# Altium project power_board.PrjPcb (part 1 of 6)
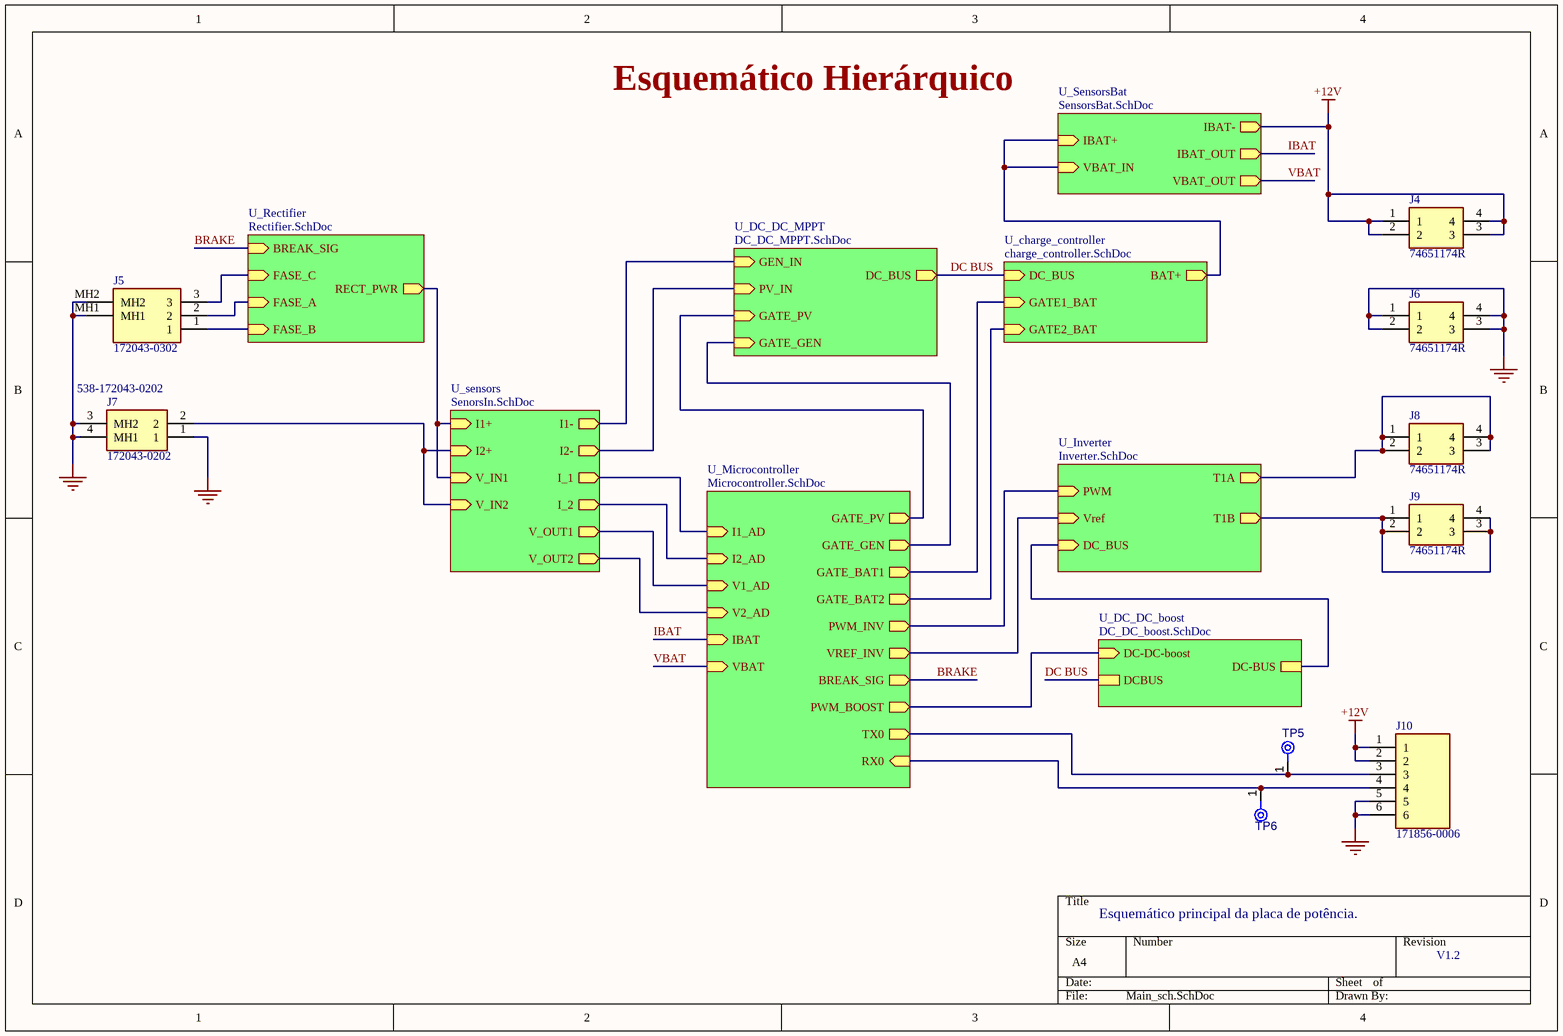
[diagram p0: Main_sch.SchDoc]
CAGE_CODE: ?????; CONTRACT_NUMBER: <CONTRACT NO>; DOC_NO_ASSY_DWG: <ASSY DWG NO>; DOC_NO_BOM: <BOM DOC NO>; DOC_NO_FAB_DWG: <FAB DWG NO>; DOC_NO_SCH_DWG: <SCH DWG NO>; PCB_2_DEC_TOL: +/-.01; PCB_3_DEC_TOL: +/-.010; PCB_ANG_TOL: +/-1/2; PCB_ASSEMBLY_NO: <PCB ASSY NO>; PCB_CHECKER: - -----; PCB_CHECKER_APP_DATE: --/--/----; PCB_DESIGNER: - -----; PCB_DESIGNER_APP_DATE: --/--/----; PCB_DWG_NO: <PCB DWG NO>; PCB_ENGINEER: - -----; PCB_ENGINEER_APP_DATE: --/--/----; PCB_PART_NUMBER: <PCB PN>; PCB_REV: A; SCH_REV: A
9 sheets, 193 parts. Net scope: hierarchical (ports join the sheet entries above them; power ports are global).
Board file: power_board.PcbDoc
Sheets:
  Main_sch.SchDoc
    U_Rectifier = Rectifier.SchDoc
    U_DC_DC_MPPT = DC_DC_MPPT.SchDoc
    U_sensors = SenorsIn.SchDoc
    U_Microcontroller = Microcontroller.SchDoc
    U_Inverter = Inverter.SchDoc
    U_SensorsBat = SensorsBat.SchDoc
    U_charge_controller = charge_controller.SchDoc
    U_DC_DC_boost = DC_DC_boost.SchDoc

## Sheet Main_sch.SchDoc
size A4; SheetNumber: 1; SheetTotal: 9

### Parts
J4  74651174R  [74651174R]
J5  172043-0302  [1720430302]
J6  74651174R  [74651174R]
J7  172043-0202  Supplier Part Number 1: 538-172043-0202  [1720430202]
J8  74651174R  [74651174R]
J9  74651174R  [74651174R]
J10  171856-0006  [HDRV6W99P0X254_1X6_1509X635X1100P]
TP5  TPAD6R  [TP06R]  (value not drawn)  (no BOM)
TP6  TPAD6R  [TP06R]  (value not drawn)  (no BOM)

### Sub-sheets
U_charge_controller = charge_controller.SchDoc: GATE1_BAT (in), GATE2_BAT (in), DC_BUS (in), BAT+ (out)
U_DC_DC_boost = DC_DC_boost.SchDoc: DC-DC-boost (in), DCBUS, DC-BUS
U_DC_DC_MPPT = DC_DC_MPPT.SchDoc: GATE_PV (in), PV_IN (in), GEN_IN (in), GATE_GEN (in), DC_BUS (out)
U_Inverter = Inverter.SchDoc: PWM (in), Vref (in), T1A (out), T1B (out), DC_BUS (in)
U_Microcontroller = Microcontroller.SchDoc: TX0 (out), RX0 (in), I1_AD (in), I2_AD (in), V1_AD (in), V2_AD (in), GATE_PV (out), GATE_GEN (out), IBAT (in), VBAT (in), GATE_BAT1 (out), GATE_BAT2 (out), BREAK_SIG (out), PWM_INV (out), VREF_INV (out), PWM_BOOST (out)
U_Rectifier = Rectifier.SchDoc: BREAK_SIG (in), FASE_C (in), FASE_A (in), FASE_B (in), RECT_PWR (out)
U_sensors = SenorsIn.SchDoc: I_2 (out), I_1 (out), V_IN1 (in), V_IN2 (in), V_OUT2 (out), V_OUT1 (out), I1- (out), I2- (out), I2+ (in), I1+ (in)
U_SensorsBat = SensorsBat.SchDoc: IBAT+ (in), IBAT- (out), IBAT_OUT (out), VBAT_IN (in), VBAT_OUT (out)

### Nets
+12V: J4.1 J4.2 J4.3 J4.4 J10.1 J10.2 ; sheet U_SensorsBat/IBAT-
GND: J5.MH1 J5.MH2 J6.1 J6.2 J6.3 J6.4 J7.1 J7.3(MH2) J7.4(MH1) J10.5 J10.6
BRAKE: sheet U_Rectifier/BREAK_SIG, sheet U_Microcontroller/BREAK_SIG
DC BUS: sheet U_DC_DC_MPPT/DC_BUS, sheet U_charge_controller/DC_BUS, sheet U_DC_DC_boost/DCBUS
DCBUS: sheet U_Inverter/DC_BUS, sheet U_DC_DC_boost/DC-BUS
IBAT: sheet U_Microcontroller/IBAT, sheet U_SensorsBat/IBAT_OUT
VBAT: sheet U_Microcontroller/VBAT, sheet U_SensorsBat/VBAT_OUT
NetC5_1: sheet U_DC_DC_MPPT/PV_IN, sheet U_sensors/I2-
NetC15_1: sheet U_Rectifier/RECT_PWR, sheet U_sensors/V_IN1, sheet U_sensors/I1+
NetC28_1: J8.1 J8.2 J8.3 J8.4 ; sheet U_Inverter/T1A
NetC28_2: J9.1 J9.2 J9.3 J9.4 ; sheet U_Inverter/T1B
NetD7_2: J5.2 ; sheet U_Rectifier/FASE_A
NetD9_2: J5.1 ; sheet U_Rectifier/FASE_B
NetD11_2: J5.3 ; sheet U_Rectifier/FASE_C
NetFL1_1: sheet U_DC_DC_MPPT/GEN_IN, sheet U_sensors/I1-
NetIC1_1: sheet U_DC_DC_MPPT/GATE_PV, sheet U_Microcontroller/GATE_PV
NetIC2_1: sheet U_DC_DC_MPPT/GATE_GEN, sheet U_Microcontroller/GATE_GEN
NetIC3_1: sheet U_Microcontroller/GATE_BAT1, sheet U_charge_controller/GATE1_BAT
NetIC4_1: sheet U_Microcontroller/GATE_BAT2, sheet U_charge_controller/GATE2_BAT
NetIC7_1: sheet U_Microcontroller/PWM_BOOST, sheet U_DC_DC_boost/DC-DC-boost
NetJ7_2: J7.2 ; sheet U_sensors/V_IN2, sheet U_sensors/I2+
NetJ10_3: J10.3 TP5.1(TP) ; sheet U_Microcontroller/TX0
NetJ10_4: J10.4 TP6.1(TP) ; sheet U_Microcontroller/RX0
NetL2_2: sheet U_SensorsBat/IBAT+, sheet U_SensorsBat/VBAT_IN, sheet U_charge_controller/BAT+
NetR5_2: sheet U_sensors/I_1, sheet U_Microcontroller/I1_AD
NetR11_2: sheet U_sensors/I_2, sheet U_Microcontroller/I2_AD
NetR32_1: sheet U_Microcontroller/PWM_INV, sheet U_Inverter/PWM
NetTP1_1: sheet U_sensors/V_OUT1, sheet U_Microcontroller/V1_AD
NetTP2_1: sheet U_sensors/V_OUT2, sheet U_Microcontroller/V2_AD
NetU7_9: sheet U_Microcontroller/VREF_INV, sheet U_Inverter/Vref

### Notes on the sheet
- Esquemático Hierárquico
- Esquemático principal da placa de potência.
- V1.2

### Library data of the parts
J4 J6 J8 J9 = 74651174R: SHANK, THR; Manufacturer_Name: Wurth Elektronik; Manufacturer: Wurth Electronics; Current Rating: 50A; Datasheet Link: https://componentsearchengine.com/Datasheets/1/74651174R.pdf; Height: 11mm; Manufacturer_Part_Number: 74651174R; Mouser Part Number: 710-74651174R; Mouser Price/Stock: https://www.mouser.co.uk/ProductDetail/Wurth-Elektronik/74651174R?qs=lBTPRtX1sU9uJ5vjuYZPZA%3D%3D; Supplier 1: Mouser; Supplier Part Number 1: 710-74651174R; Manufacturer Part Number: 74651174R; RoHS: Yes; Category: Terminals; Stock 1: 997; Pricing 1: 1=3.26000, 10=3.02000, 50=2.71000, 100=2.45000, 1000=2.06000, 10000=2.06000 (USD); Mount: Through Hole; Number of Pins: 4; Contact Plating: Tin; Contact Material: Brass; Termination: Solder; RoHS Compliant: Yes; ComponentLink1URL: http://katalog.we-online.de/em/datasheet/74651174R.pdf?src-supplier=Digi-Key; ComponentLink1Description: http://katalog.we-online.de/em/datasheet/74651174R.pdf?src-supplier=Digi-Key; ComponentLink2URL: https://katalog.we-online.de/em/datasheet/74651174R.pdf?src-supplier=Digi-Key; ComponentLink2Description: https://katalog.we-online.de/em/datasheet/74651174R.pdf?src-supplier=Digi-Key
J5 = 172043-0302: Conn Power HDR 3 POS 7.49mm Solder RA Thru-Hole 3 Terminal 1 Port Super Sabre™ Frame; Manufacturer_Name: Molex; Number of Positions: 3; Voltage Rating: 600V; Current Rating: 30A; Pitch: 0.295inch; Glow Wire Compliant: Compliant; Datasheet Link: https://www.molex.com/pdm_docs/sd/1720430401_sd.pdf; Height: 11.53mm; Manufacturer_Part_Number: 172043-0302; ComponentLink1URL: http://www.molex.com/pdm_docs/sd/1720430202_sd.pdf?src-supplier=Avnet; ComponentLink1Description: http://www.molex.com/pdm_docs/sd/1720430202_sd.pdf?src-supplier=Avnet; ComponentLink2URL: http://www.molex.com/pdm_docs/sd/1720430302_sd.pdf?src-supplier=Digi-Key; ComponentLink2Description: http://www.molex.com/pdm_docs/sd/1720430302_sd.pdf?src-supplier=Digi-Key; ComponentLink3URL: https://www.molex.com/pdm_docs/sd/1720430302_sd.pdf?src-supplier=Digi-Key; ComponentLink3Description: https://www.molex.com/pdm_docs/sd/1720430302_sd.pdf?src-supplier=Digi-Key; ComponentLink4URL: https://www.mouser.com/ds/2/276/1720430202_PCB_HEADERS-704499.pdf?src-supplier=Mouser; ComponentLink4Description: https://www.mouser.com/ds/2/276/1720430202_PCB_HEADERS-704499.pdf?src-supplier=Mouser; ComponentLink5URL: http://www.literature.molex.com/SQLImages/kelmscott/Molex/PDF_Images/987650-1349.PDF?src-supplier=Digi-Key; ComponentLink5Description: http://www.literature.molex.com/SQLImages/kelmscott/Molex/PDF_Images/987650-1349.PDF?src-supplier=Digi-Key; ComponentLink6URL: http://www.molex.com/pdm_docs/sd/1720430202_sd.pdf?src-supplier=Digi-Key; ComponentLink6Description: http://www.molex.com/pdm_docs/sd/1720430202_sd.pdf?src-supplier=Digi-Key; Supplier 1: Mouser; Supplier Part Number 1: 538-172043-0302; Manufacturer: Molex; Manufacturer Part Number: 1720430302; RoHS: Yes; Category: Headers and Wire Housings; Stock 1: 770; Pricing 1: 1=4.13000, 10=3.64000, 50=3.64000, 100=2.90000, 1000=2.39000, 10000=2.23000 (USD); Mount: Through Hole; Number of Pins: 3; Color: Black; Contact Material: Copper; Contact Plating: Silver; Insulation Material: Polymer; Min Operating Temperature: -40°C; Max Operating Temperature: 125°C; Packaging: Tray; Number of Rows: 1; Termination: Solder; Fastening Type: Ramp; Orientation: Right Angle; Number of Circuits: 3; Halogen Free: Low Halogen; RoHS Compliant: Yes
J7 = 172043-0202: CONN HDR 2POS 7.50MM R/A SLDR; Manufacturer_Name: Molex; Number of Positions: 2; Voltage Rating: 600V; Current Rating: 30A; Pitch: 0.295inch; Datasheet Link: https://www.molex.com/pdm_docs/sd/1720430202_sd.pdf; Height: 11.68mm; Manufacturer_Part_Number: 172043-0202; Mouser Part Number: 538-172043-0202; Mouser Price/Stock: https://www.mouser.co.uk/ProductDetail/Molex/172043-0202?qs=AUG1J5sL7zJwcA2Oseq0RA%3D%3D; Supplier 1: Mouser; Manufacturer: Molex; Manufacturer Part Number: 1720430202; RoHS: Yes; Category: Cables and Wire; Stock 1: 939; Pricing 1: 1=2.21000, 10=1.89000, 50=1.89000, 100=1.56000, 1000=1.22000, 10000=1.08000 (USD); Mount: Through Hole; Number of Pins: 2; Color: Black; Contact Material: Copper; Contact Plating: Silver; Insulation Material: Polymer; Min Operating Temperature: -40°C; Max Operating Temperature: 125°C; Packaging: Tray; Number of Rows: 1; Termination: Solder; Fastening Type: Ramp; Orientation: Right Angle; Number of Circuits: 2; RoHS Compliant: Yes; ComponentLink1URL: https://www.mouser.com/ds/2/276/1720430202_PCB_HEADERS-704499.pdf?src-supplier=Mouser; ComponentLink1Description: https://www.mouser.com/ds/2/276/1720430202_PCB_HEADERS-704499.pdf?src-supplier=Mouser; ComponentLink2URL: http://www.molex.com/pdm_docs/sd/1720430202_sd.pdf?src-supplier=Avnet; ComponentLink2Description: http://www.molex.com/pdm_docs/sd/1720430202_sd.pdf?src-supplier=Avnet; ComponentLink3URL: http://www.literature.molex.com/SQLImages/kelmscott/Molex/PDF_Images/987650-1349.PDF?src-supplier=Digi-Key; ComponentLink3Description: http://www.literature.molex.com/SQLImages/kelmscott/Molex/PDF_Images/987650-1349.PDF?src-supplier=Digi-Key; ComponentLink4URL: http://www.molex.com/pdm_docs/sd/1720430202_sd.pdf?src-supplier=Digi-Key; ComponentLink4Description: http://www.molex.com/pdm_docs/sd/1720430202_sd.pdf?src-supplier=Digi-Key
J10 = 171856-0006: Conn Wire to Board HDR 6 POS 2.54mm Solder ST Thru-Hole KK® Bag; Manufacturer_Name: Molex; Current Rating: 4A; Voltage Rating: 250V; Number of Positions: 6; Gender: Male; Connector Type: Male Pin; Contact Post Length: 2.34mm; Glow Wire Compliant: Compliant; Datasheet Link: https://www.molex.com/pdm_docs/sd/1718560006_sd.pdf; Height: 11mm; Manufacturer_Part_Number: 171856-0006; Mouser Part Number: 538-171856-0006; Mouser Price/Stock: https://www.mouser.co.uk/ProductDetail/Molex/171856-0006?qs=s7UCm7gO1bZ%2FF4kPA9T7bA%3D%3D; Supplier 1: Mouser; Supplier Part Number 1: 538-171856-0006; Manufacturer: Molex; Manufacturer Part Number: 171856-0006; RoHS: Yes; Category: Headers and Wire Housings; Stock 1: 7773; Pricing 1: 1=0.52000, 10=0.44100, 50=0.44100, 100=0.34400, 1000=0.27000, 10000=0.22000 (USD); Mount: Through Hole; Contact Plating: Tin,Matte; Contact Material: Brass,Tin; Color: Black; Housing Color: Black; Housing Material: Nylon; Weight: 0.023916oz; Min Operating Temperature: -40°C; Max Operating Temperature: 105°C; Number of Rows: 1; Contact Gender: Male; Packaging: Bulk; Package Quantity: 2000; Fastening Type: Friction; Termination: Solder; Number of Contacts: 6; Orientation: Vertical; Number of Circuits: 6; Length: 15.09mm; Pitch: 2.54mm; Contact Mating Length: 0.293inch; Depth: 6.35mm; Radiation Hardening: No; REACH SVHC: Unknown; Halogen Free: Low Halogen; Flammability Rating: UL94 V-2; RoHS Compliant: Yes; ComponentLink1URL: https://datasheet.ciiva.com/24135/1718560006-pcb-headers-295618-24135976.pdf?src-supplier=Mouser; ComponentLink1Description: https://datasheet.ciiva.com/24135/1718560006-pcb-headers-295618-24135976.pdf?src-supplier=Mouser; ComponentLink2URL: https://datasheet.ciiva.com/30069/162461718560006-pcb-headers-30069863.pdf?src-supplier=Onlinecomponents.com; ComponentLink2Description: https://datasheet.ciiva.com/30069/162461718560006-pcb-headers-30069863.pdf?src-supplier=Onlinecomponents.com; ComponentLink3URL: https://datasheet.ciiva.com/28500/1769843-28500365.pdf?src-supplier=Element14; ComponentLink3Description: https://datasheet.ciiva.com/28500/1769843-28500365.pdf?src-supplier=Element14; ComponentLink4URL: https://datasheet.ciiva.com/30492/0900766b8129e59b-30492739.pdf?src-supplier=RSComponents; ComponentLink4Description: https://datasheet.ciiva.com/30492/0900766b8129e59b-30492739.pdf?src-supplier=RSComponents; ComponentLink5URL: https://datasheet.ciiva.com/29948/1718560002-sd-29948527.pdf?src-supplier=Avnet; ComponentLink5Description: https://datasheet.ciiva.com/29948/1718560002-sd-29948527.pdf?src-supplier=Avnet; ComponentLink6URL: https://datasheet.ciiva.com/30514/70314281-30514598.pdf?src-supplier=Allied+Electronics; ComponentLink6Description: https://datasheet.ciiva.com/30514/70314281-30514598.pdf?src-supplier=Allied+Electronics
TP5 TP6 = CMP-00028-00002-2: 0.6mm round; Pins: 1

## Sheet Rectifier.SchDoc
size A4; SheetNumber: 5; SheetTotal: 9
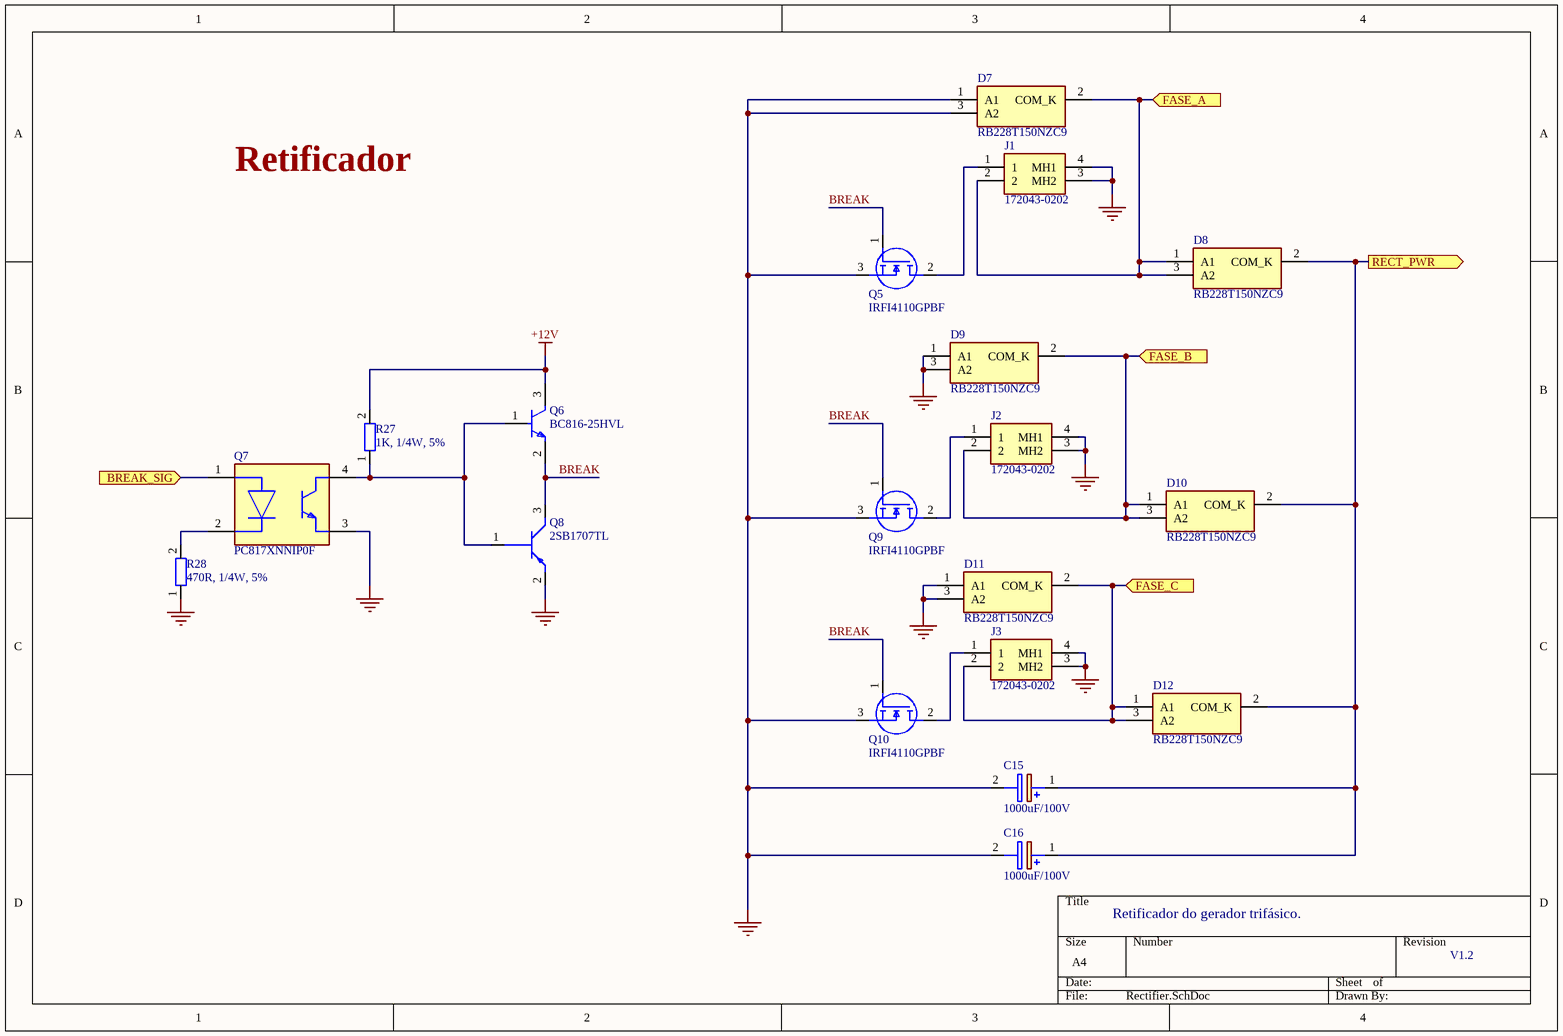
[diagram p1: Rectifier.SchDoc]

### Parts
C15  1000uF/100V  [CAPPRD750W85D1800H3750]
C16  1000uF/100V  [CAPPRD750W85D1800H3750]
D7  RB228T150NZC9  [TO254P480X1010X2100-3P]
D8  RB228T150NZC9  [TO254P480X1010X2100-3P]
D9  RB228T150NZC9  [TO254P480X1010X2100-3P]
D10  RB228T150NZC9  [TO254P480X1010X2100-3P]
D11  RB228T150NZC9  [TO254P480X1010X2100-3P]
D12  RB228T150NZC9  [TO254P480X1010X2100-3P]
J1  172043-0202  [1720430202]
J2  172043-0202  [1720430202]
J3  172043-0202  [1720430202]
Q5  IRFI4110GPBF  [TO254P483X1018X2095-3P]
Q6  BC816-25HVL  [FP-SOT23-IPC_C]
Q7  PC817XNNIP0F  [FP-PC817XNNIP0F-MFG]
Q8  2SB1707TL  [SOT95P280X100-3N]
Q9  IRFI4110GPBF  [TO254P483X1018X2095-3P]
Q10  IRFI4110GPBF  [TO254P483X1018X2095-3P]
R27  1K, 1/4W, 5%  [RES-0805]
R28  470R, 1/4W, 5%  [RES-0805]

### Ports
BREAK_SIG (in), FASE_A (in), FASE_B (in), FASE_C (in), RECT_PWR (out)

### Nets
+12V: Q6.3(C) R27.2
GND: C15.2(-) C16.2(-) D7.1(A1) D7.3(A2) D9.1(A1) D9.3(A2) D11.1(A1) D11.3(A2) J1.3(MH2) J1.4(MH1) J2.3(MH2) J2.4(MH1) J3.3(MH2) J3.4(MH1) Q5.3(S) Q7.3(E) Q8.2(E) Q9.3(S) Q10.3(S) R28.1
BRAKE: Q7.1(A) ; port BREAK_SIG
BREAK: Q5.1(G) Q6.2(E) Q8.3(C) Q9.1(G) Q10.1(G)
NetC15_1: C15.1(+) C16.1(+) D8.2(COM_K) D10.2(COM_K) D12.2(COM_K) ; port RECT_PWR
NetD7_2: D7.2(COM_K) D8.1(A1) D8.3(A2) J1.2 ; port FASE_A
NetD9_2: D9.2(COM_K) D10.1(A1) D10.3(A2) J2.2 ; port FASE_B
NetD11_2: D11.2(COM_K) D12.1(A1) D12.3(A2) J3.2 ; port FASE_C
NetJ1_1: J1.1 Q5.2(D)
NetJ2_1: J2.1 Q9.2(D)
NetJ3_1: J3.1 Q10.2(D)
NetQ6_1: Q6.1(B) Q7.4(C) Q8.1(B) R27.1
NetQ7_2: Q7.2(C) R28.2

### Notes on the sheet
- Retificador
- Retificador do gerador trifásico.
- V1.2

### Library data of the parts
C15 C16 = ECA-2AHG102: Aluminum Electrolytic Capacitors - Leaded 1000uF 100V; Manufacturer_Name: Panasonic; Capacitance: 1mF; Tolerance: 20%; Ripple Current: 985mA; Leakage Current: 3uA; Life (Hours): 2000Hour; Dissipation Factor: 0.08%; Lead/Base Style: Straight; Lead Diameter: 0.8mm; Datasheet Link: http://www.mouser.com/ds/2/315/ABA0000C1215-1109177.pdf; Height: 37.5mm; Manufacturer_Part_Number: ECA-2AHG102; Mouser Part Number: 667-ECA-2AHG102; Mouser Price/Stock: https://www.mouser.co.uk/ProductDetail/Panasonic/ECA-2AHG102/?qs=rrcJgg%2Fw9KxYcZZHtVYgiQ%3D%3D; Arrow Part Number: ECA-2AHG102; Arrow Price/Stock: https://www.arrow.com/en/products/eca-2ahg102/panasonic; Supplier 1: Mouser; Supplier Part Number 1: 667-ECA-2AHG102; Manufacturer: Panasonic; Manufacturer Part Number: ECA-2AHG102; RoHS: Yes; Category: Aluminum Electrolytic Capacitors; Stock 1: 994; Pricing 1: 1=2.62000, 10=1.75000, 50=1.75000, 100=1.60000, 1000=1.07000, 10000=1.07000 (USD); Mount: Through Hole,PCB; Case/Package: Radial; Number of Pins: 2; Contact Plating: Tin; Min Operating Temperature: -55°C; Max Operating Temperature: 105°C; Termination: Radial; Voltage Rating: 100V; Packaging: Bulk; Package Quantity: 50; Voltage Rating (DC): 100V; Voltage: 100V; Series: NHG; Construction: RADIAL; Diameter: 18mm; Length: 35.5mm; Width: 18mm; Lead Pitch: 7.5mm; Height - Seated (Max): 1.476inch; Radiation Hardening: No; REACH SVHC: No SVHC; Lead Free: Lead Free; RoHS Compliant: Yes; ComponentLink1URL: https://datasheet.ciiva.com/2984/aba0000ce26-2984390.pdf?src-supplier=Avnet; ComponentLink1Description: https://datasheet.ciiva.com/2984/aba0000ce26-2984390.pdf?src-supplier=Avnet; ComponentLink2URL: https://datasheet.ciiva.com/43459/1790596-43459676.pdf?src-supplier=Farnell; ComponentLink2Description: https://datasheet.ciiva.com/43459/1790596-43459676.pdf?src-supplier=Farnell; ComponentLink3URL: https://datasheet.ciiva.com/24027/aba0000ce26-372437-24027279.pdf?src-supplier=Mouser; ComponentLink3Description: https://datasheet.ciiva.com/24027/aba0000ce26-372437-24027279.pdf?src-supplier=Mouser; ComponentLink4URL: https://datasheet.ciiva.com/30158/8aba0000ce26-30158524.pdf?src-supplier=Onlinecomponents.com; ComponentLink4Description: https://datasheet.ciiva.com/30158/8aba0000ce26-30158524.pdf?src-supplier=Onlinecomponents.com; ComponentLink5URL: https://datasheet.ciiva.com/16387/aba0000ce26-16387053.pdf?src-supplier=Future+Electronics; ComponentLink5Description: https://datasheet.ciiva.com/16387/aba0000ce26-16387053.pdf?src-supplier=Future+Electronics; ComponentLink6URL: https://datasheet.ciiva.com/14594/70067776-14594090.pdf?src-supplier=Allied+Electronics; ComponentLink6Description: https://datasheet.ciiva.com/14594/70067776-14594090.pdf?src-supplier=Allied+Electronics; ComponentLink7URL: https://datasheet.ciiva.com/15198/getdatasheetpartid-470872-15198006.pdf?src-supplier=Verical; ComponentLink7Description: https://datasheet.ciiva.com/15198/getdatasheetpartid-470872-15198006.pdf?src-supplier=Verical; ComponentLink8URL: https://datasheet.ciiva.com/17533/aba0000ce26-17533421.pdf?src-supplier=Avnet+Europe; ComponentLink8Description: https://datasheet.ciiva.com/17533/aba0000ce26-17533421.pdf?src-supplier=Avnet+Europe; ComponentLink9URL: https://datasheet.ciiva.com/29248/792491-da-01-en-elko-nhg-r-1000uf-100v-105c-29248620.pdf?src-supplier=Conrad; ComponentLink9Description: https://datasheet.ciiva.com/29248/792491-da-01-en-elko-nhg-r-1000uf-100v-105c-29248620.pdf?src-supplier=Conrad
D7-D12 = RB228T150NZC9: Schottky Diode; Manufacturer_Name: ROHM Semiconductor; Manufacturer: Rohm; Datasheet Link: https://fscdn.rohm.com/en/products/databook/datasheet/discrete/diode/schottky_barrier/rb228t150nz-e.pdf; Height: 4.8mm; Manufacturer_Part_Number: RB228T150NZC9; Supplier 1: Mouser; Supplier Part Number 1: 755-RB228T150NZC9; Manufacturer Part Number: RB228T150NZC9; RoHS: Yes; Stock 1: 982; Pricing 1: 1=1.74000, 10=1.48000, 50=1.48000, 100=1.14000, 1000=0.82400, 10000=0.78200 (USD)
J1-J3 = 172043-0202: as J7 on sheet Main_sch; Datasheet Link: https://www.molex.com/pdm_docs/sd/1720430202_sd.pdf; Height: 11.68mm; Manufacturer_Part_Number: 172043-0202; Mouser Part Number: 538-172043-0202; Mouser Price/Stock: https://www.mouser.co.uk/ProductDetail/Molex/172043-0202?qs=AUG1J5sL7zJwcA2Oseq0RA%3D%3D; Supplier 1: Mouser; Supplier Part Number 1: 538-172043-0202; Manufacturer: Molex; Manufacturer Part Number: 1720430202; RoHS: Yes; Category: Cables and Wire; Stock 1: 939; Pricing 1: 1=2.21000, 10=1.89000, 50=1.89000, 100=1.56000, 1000=1.22000, 10000=1.08000 (USD); Mount: Through Hole; Number of Pins: 2; Color: Black; Contact Material: Copper; Contact Plating: Silver; Insulation Material: Polymer; Min Operating Temperature: -40°C; Max Operating Temperature: 125°C; Packaging: Tray; Number of Rows: 1; Termination: Solder; Fastening Type: Ramp; Orientation: Right Angle; Number of Circuits: 2; RoHS Compliant: Yes; ComponentLink1URL: https://www.mouser.com/ds/2/276/1720430202_PCB_HEADERS-704499.pdf?src-supplier=Mouser; ComponentLink1Description: https://www.mouser.com/ds/2/276/1720430202_PCB_HEADERS-704499.pdf?src-supplier=Mouser; ComponentLink2URL: http://www.molex.com/pdm_docs/sd/1720430202_sd.pdf?src-supplier=Avnet; ComponentLink2Description: http://www.molex.com/pdm_docs/sd/1720430202_sd.pdf?src-supplier=Avnet; ComponentLink3URL: http://www.literature.molex.com/SQLImages/kelmscott/Molex/PDF_Images/987650-1349.PDF?src-supplier=Digi-Key; ComponentLink3Description: http://www.literature.molex.com/SQLImages/kelmscott/Molex/PDF_Images/987650-1349.PDF?src-supplier=Digi-Key; ComponentLink4URL: http://www.molex.com/pdm_docs/sd/1720430202_sd.pdf?src-supplier=Digi-Key; ComponentLink4Description: http://www.molex.com/pdm_docs/sd/1720430202_sd.pdf?src-supplier=Digi-Key
Q5 Q9 Q10 = IRFI4110GPBF: MOSFET N-CH 100V 72A TO220AB; Manufacturer_Name: Infineon; Rds On Max: 4.5mR; Input Capacitance: 9.54nF; Max Power Dissipation: 61W; Threshold Voltage: 4V; Datasheet Link: https://www.mouser.co.uk/datasheet/2/196/Infineon-IRFI4110G-DS-v01_02-EN-1227339.pdf; Height: 4.83mm; Manufacturer_Part_Number: IRFI4110GPBF; Mouser Part Number: 942-IRFI4110GPBF; Mouser Price/Stock: https://www.mouser.com/Search/Refine.aspx?Keyword=942-IRFI4110GPBF; Arrow Part Number: IRFI4110GPBF; Arrow Price/Stock: https://www.arrow.com/en/products/irfi4110gpbf/infineon-technologies-ag; Supplier 1: Mouser; Supplier Part Number 1: 942-IRFI4110GPBF; Manufacturer: Infineon; Manufacturer Part Number: IRFI4110GPBF; RoHS: Yes; Category: MOSFETs; Stock 1: 1795; Pricing 1: 1=3.31000, 10=2.79000, 50=2.63000, 100=2.25000, 1000=1.72000, 10000=1.59000 (USD); Mount: Through Hole; Case/Package: TO-220-3; Number of Pins: 3; Min Operating Temperature: -55°C; Max Operating Temperature: 175°C; Continuous Drain Current (ID): 72A; Packaging: Rail/Tube; Drain to Source Voltage (Vdss): 100V; Max Dual Supply Voltage: 100V; REACH SVHC: No SVHC; Lead Free: Lead Free; RoHS Compliant: Yes; Halogen Free: Halogen Free; ComponentLink1URL: http://www.infineon.com/dgdl/irfi4110gpbf.pdf?fileId=5546d462533600a401535623f28d1f78&src-supplier=Digi-Key; ComponentLink1Description: http://www.infineon.com/dgdl/irfi4110gpbf.pdf?fileId=5546d462533600a401535623f28d1f78&src-supplier=Digi-Key; ComponentLink2URL: http://www.farnell.com/datasheets/1302157.pdf?src-supplier=Element14; ComponentLink2Description: http://www.farnell.com/datasheets/1302157.pdf?src-supplier=Element14
Q6 = CMP-14406-000028-1: BC816-25H/SOT23/TO-236AB; Manufacturer: Nexperia; Supplier 1: Mouser; Supplier Part Number 1: 771-BC816-25HVL; Manufacturer Part Number: BC816-25HVL; RoHS: No; Stock 1: 11733; Pricing 1: 1=0.25000, 10=0.17100, 50=0.17100, 100=0.08300, 1000=0.04800, 10000=0.03200 (USD)
Q7 = CMP-65434-000005-1: OPTOISOLATOR 5KV TRANS 4SMD; Manufacturer: Sharp; Reverse Breakdown Voltage: 6V; Output Current per Channel: 30mA; Power Dissipation: 200mW; Collector-emitter Voltage-Max: 200mV; Max Output Voltage: 80V; Input Current: 50mA; Forward Voltage: 1.4V; Fall Time: 18000ns; Number of Elements: 1; Input Type: DC; Packaging: Tape and Reel; RoHS Compliant: Yes; Contact Plating: Copper; Min Operating Temperature: -30°C; Collector Emitter Saturation Voltage: 200mV; Max Input Current: 50mA; Radiation Hardening: No; Max Collector Current: 50mA; Case/Package: SMD/SMT; Mount: Surface Mount; Output Voltage: 80V; Forward Current: 50mA; Max Power Dissipation: 200mW; Collector Emitter Voltage (VCEO): 80V; Number of Channels: 1; Rise Time: 18000ns; Isolation Voltage: 5kV; Number of Pins: 4; Lead Free: Lead Free; Package Quantity: 2000; Isolation Voltage-Max: 5kV; Max Operating Temperature: 100°C; Supplier 1: Digi-Key; Supplier Part Number 1: 425-2774-1-ND; Manufacturer Part Number: PC817XNNIP0F; RoHS: Yes; Category: Optocouplers; REACH SVHC: Unknown; ComponentLink1URL: https://datasheet.ciiva.com/15119/getdatasheetpartid-299374-15119023.pdf?src-supplier=Verical; ComponentLink1Description: https://datasheet.ciiva.com/15119/getdatasheetpartid-299374-15119023.pdf?src-supplier=Verical; ComponentLink2URL: https://datasheet.ciiva.com/2086/pc817xxnip0f-series-2086507.pdf?src-supplier=Digi-Key; ComponentLink2Description: https://datasheet.ciiva.com/2086/pc817xxnip0f-series-2086507.pdf?src-supplier=Digi-Key; ComponentLink3URL: https://datasheet.ciiva.com/2086/pc817xxnip0f-series-2086508.pdf?src-supplier=Digi-Key; ComponentLink3Description: https://datasheet.ciiva.com/2086/pc817xxnip0f-series-2086508.pdf?src-supplier=Digi-Key; ComponentLink4URL: https://datasheet.ciiva.com/2086/pc817xxnip0f-series-2086509.pdf?src-supplier=Digi-Key; ComponentLink4Description: https://datasheet.ciiva.com/2086/pc817xxnip0f-series-2086509.pdf?src-supplier=Digi-Key; ComponentLink5URL: https://datasheet.ciiva.com/16475/pc817xnnip0f-16475911.pdf?src-supplier=Future+Electronics; ComponentLink5Description: https://datasheet.ciiva.com/16475/pc817xnnip0f-16475911.pdf?src-supplier=Future+Electronics; ComponentLink6URL: https://datasheet.ciiva.com/25900/pc817xxnip0f-series-25900837.pdf?src-supplier=Avnet+Europe; ComponentLink6Description: https://datasheet.ciiva.com/25900/pc817xxnip0f-series-25900837.pdf?src-supplier=Avnet+Europe; ComponentLink7URL: https://datasheet.ciiva.com/46396/1812378-46396954.pdf?src-supplier=Element14; ComponentLink7Description: https://datasheet.ciiva.com/46396/1812378-46396954.pdf?src-supplier=Element14; ComponentLink8URL: https://datasheet.ciiva.com/46435/1812378-46435723.pdf?src-supplier=Element14; ComponentLink8Description: https://datasheet.ciiva.com/46435/1812378-46435723.pdf?src-supplier=Element14
Q8 = 2SB1707TL: TRANS PNP 12V 4A TSMT3; Manufacturer_Name: ROHM Semiconductor; Manufacturer: Rohm; Max Power Dissipation: 500mW; Collector Base Voltage (VCBO): -15V; hFE Min: 270; Transition Frequency: 250MHz; Emitter Base Voltage (VEBO): -6V; Collector Emitter Saturation Voltage: -150mV; Element Configuration: Single; Continuous Collector Current: -4A; Max Frequency: 100MHz; Voltage Rating (DC): -12V; Collector-emitter Voltage-Max: 250mV; Datasheet Link: https://fscdn.rohm.com/en/products/databook/datasheet/discrete/transistor/bipolar/2sb1707tl-e.pdf; Height: 1mm; Manufacturer_Part_Number: 2SB1707TL; Mouser Part Number: 755-2SB1707TL; Mouser Price/Stock: https://www.mouser.com/Search/Refine.aspx?Keyword=755-2SB1707TL; Supplier 1: Mouser; Supplier Part Number 1: 755-2SB1707TL; Manufacturer Part Number: 2SB1707TL; RoHS: Yes; Category: BJTs; Stock 1: 2939; Pricing 1: 1=0.69000, 10=0.57100, 50=0.57100, 100=0.34600, 1000=0.29500, 10000=0.25200 (USD); Mount: Surface Mount; Case/Package: TO-236-3; Number of Pins: 3; Contact Plating: Copper,Tin,Silver; Min Operating Temperature: -55°C; Max Operating Temperature: 150°C; Collector Emitter Voltage (VCEO): 12V; Max Collector Current: 4A; Packaging: Tape and Reel; Package Quantity: 3000; Polarity: PNP; Collector Emitter Breakdown Voltage: 12V; Max Breakdown Voltage: 12V; Gain Bandwidth Product: 250MHz; Current Rating: -4A; Series: -; Length: 2.9mm; Width: 1.6mm; Radiation Hardening: No; Lead Free: Lead Free; RoHS Compliant: Yes; ComponentLink1URL: https://datasheet.ciiva.com/978/2sb1707-978075.pdf?src-supplier=Digi-Key; ComponentLink1Description: https://datasheet.ciiva.com/978/2sb1707-978075.pdf?src-supplier=Digi-Key; ComponentLink2URL: https://datasheet.ciiva.com/11203/2sb1707-11203670.pdf?src-supplier=Avnet; ComponentLink2Description: https://datasheet.ciiva.com/11203/2sb1707-11203670.pdf?src-supplier=Avnet; ComponentLink3URL: https://datasheet.ciiva.com/16289/2sb1707-210615-16289360.pdf?src-supplier=Mouser; ComponentLink3Description: https://datasheet.ciiva.com/16289/2sb1707-210615-16289360.pdf?src-supplier=Mouser; ComponentLink4URL: https://datasheet.ciiva.com/978/2sb1707-978076.pdf?src-supplier=Digi-Key; ComponentLink4Description: https://datasheet.ciiva.com/978/2sb1707-978076.pdf?src-supplier=Digi-Key; ComponentLink5URL: https://datasheet.ciiva.com/978/2sb1707-978077.pdf?src-supplier=Digi-Key; ComponentLink5Description: https://datasheet.ciiva.com/978/2sb1707-978077.pdf?src-supplier=Digi-Key
R27 = Res-0805: Res General Purpose Thick Film 0805 1k Ohm 5% 1/4W ±200ppm/°C Molded Paper T/R; Manufacturer_Name: YAGEO (PHYCOMP); Manufacturer_Part_Number: RC0805JR-131KL; Manufacturer: Yageo; Manufacturer Part Number: RC0805JR-7W1KL; Resistance: 1kR; Datasheet Link: http://www.yageo.com/documents/recent/PYu-RC_Group_51_RoHS_L_10.pdf; Height: 0.6mm; Mouser Part Number: 603-RC0805JR-131KL; Mouser Price/Stock: https://www.mouser.com/Search/Refine.aspx?Keyword=603-RC0805JR-131KL; Supplier 1: Mouser; Supplier Part Number 1: 603-RC0805JR-7W1KL; RoHS: Yes; Category: Resistors; Stock 1: 3681; Pricing 1: 1=0.17000, 10=0.10800, 50=0.10800, 100=0.03500, 1000=0.02500, 10000=0.01800 (USD); Case/Package: 0805; Tolerance: 5%; RoHS Compliant: Yes
R28 = Res-0805: Thick Film Resistors - SMD 470 OHM 5%; Manufacturer_Name: YAGEO (PHYCOMP); Manufacturer_Part_Number: RC0805JR-131KL; Manufacturer: Yageo; Manufacturer Part Number: RC0805JR-13470RL; Temperature Coefficient: 100ppm/°C; Power Rating: 125mW; Voltage Rating: 150V; Datasheet Link: http://www.yageo.com/documents/recent/PYu-RC_Group_51_RoHS_L_10.pdf; Height: 0.6mm; Mouser Part Number: 603-RC0805JR-131KL; Mouser Price/Stock: https://www.mouser.com/Search/Refine.aspx?Keyword=603-RC0805JR-131KL; Supplier 1: Mouser; Supplier Part Number 1: 603-RC0805JR-13470RL; RoHS: Yes; Category: Chip SMD Resistors; Stock 1: 48513; Pricing 1: 1=0.12000, 10=0.01700, 50=0.01700, 100=0.00600, 1000=0.00500, 10000=0.00400 (USD); Case/Package: 0805; Contact Plating: Tin,Matte; Case Code (Imperial): 0805; Case Code (Metric): 2012; Min Operating Temperature: -55°C; Max Operating Temperature: 155°C; Resistance: 470R; Tolerance: 5%; Resistor Type: Thick Film; Packaging: Tape and Reel; Termination: SMD/SMT; Series: RC; Construction: Rectangular; Length: 2mm; Width: 1.25mm; Depth: 1.25mm; Radiation Hardening: No; Military Standard: Not; RoHS Compliant: Yes; ComponentLink1URL: http://www.mouser.com/ds/2/447/Yageo_08112016_RC0805-968729.pdf?src-supplier=Mouser; ComponentLink1Description: http://www.mouser.com/ds/2/447/Yageo_08112016_RC0805-968729.pdf?src-supplier=Mouser; ComponentLink2URL: http://components.arrow.com/part/dataview/0323_04018308?src-supplier=Arrow+Europe; ComponentLink2Description: http://components.arrow.com/part/dataview/0323_04018308?src-supplier=Arrow+Europe; ComponentLink3URL: http://www.yageo.com/documents/recent/PYu-RC0805_51_RoHS_L-(4).pdf?src-supplier=Avnet+Europe; ComponentLink3Description: http://www.yageo.com/documents/recent/PYu-RC0805_51_RoHS_L-(4).pdf?src-supplier=Avnet+Europe